# Altium project cooling_shield.PrjPCB
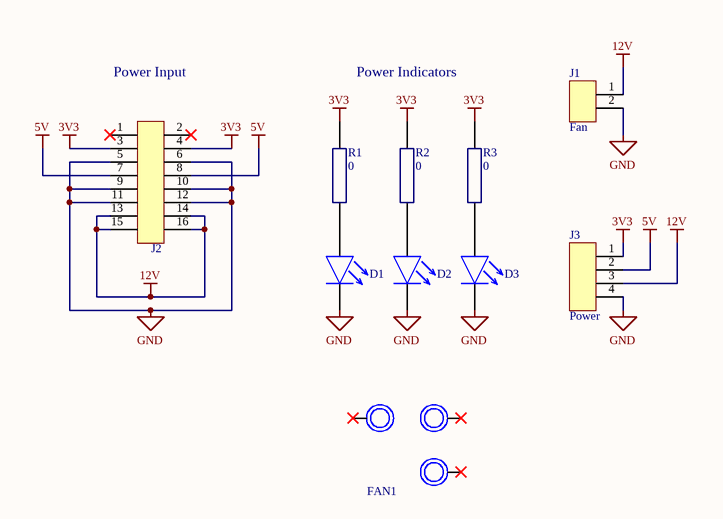
[diagram p0: cooling_shield.SchDoc]
1 sheet, 10 parts. Net scope: global (net labels, ports and power ports of the same name join across sheets).
Board file: cooling_shield.PcbDoc

## Sheet cooling_shield.SchDoc
size A

### Parts
D1  XZFBB45S-9  [PLCC-2]  (value not drawn)
D2  XZFBB45S-9  [PLCC-2]  (value not drawn)
D3  XZFBB45S-9  [PLCC-2]  (value not drawn)
FAN1  fan  [fan]  (value not drawn)
J1  Fan  [1718561002]
J2  DF11-16DP-2DSA(01)  [DF11-16DP-2DSA(01)_FLIP]  (value not drawn)
J3  Power  [282834-4]
R1  0  [RESC2012X07N_SAMSUNG]
R2  0  [RESC2012X07N_SAMSUNG]
R3  0  [RESC2012X07N_SAMSUNG]

### Nets
3V3: J2.3 J2.4 J3.1 R1.2 R2.2 R3.2
5V: J2.7 J2.8 J3.2
12V: J1.1 J2.13 J2.14 J2.15 J2.16 J3.3
GND: D1.2 D2.2 D3.2 J1.2 J2.5 J2.6 J2.9 J2.10 J2.11 J2.12 J3.4
NetD1_1: D1.1 R1.1
NetD2_1: D2.1 R2.1
NetD3_1: D3.1 R3.1

Not connected (* = marked no-connect by the designer): FAN1 1* 2* 3*; J2 1* 2*

### Notes on the sheet
- Power Input
- Power Indicators

### Library data of the parts
D1-D3 = XZFBB45S-9: LED BLUE CLEAR 2PLCC SMD; Manufacturer: SunLED; Configuration: Standard; Lens Color: Colorless; Millicandela Rating: 447mcd; Lens Style: Round with Flat Top; Lens Size: 2.40mm Dia; Voltage - Forward (Vf) (Typ): 3.3V; Current - Test: 20mA; Viewing Angle: 120°; Wavelength - Dominant: 470nm; Wavelength - Peak: 465nm; Supplier 1: Digi-Key; Manufacturer Part Number: XZFBB45S-9; RoHS: RoHS Compliant; Category: Optoelectronics; Stock 1: 5275; Pricing 1: 1=0.83, 10=0.651, 25=0.5456, 100=0.4752, 250=0.4224, 500=0.3696, 1000=0.2992 (USD); Packaging: Cut Tape (CT); Part Status: Active; Color: Blue; Lens Transparency: Clear; Mounting Type: Surface Mount, Bottom Entry; Features: -; Package / Case: 2-SMD, Z-Bend; Supplier Device Package: 2-PLCC; Size / Dimension: 3.20mm L x 2.80mm W; Height (Max): 1.90mm; ComponentLink1URL: http://www.sunledusa.com/products/spec/XZFBB45S-9.pdf; ComponentLink1Description: http://www.sunledusa.com/products/spec/XZFBB45S-9.pdf; Supplier Part Number 1: 1497-1233-1-ND
FAN1 = fan: RND STANDOFF M2.5X0.45 STEEL 8MM; Manufacturer: Wurth Electronics; Manufacturer Part Number: 9774080151R; Plating: Tin; Threaded/Unthreaded: Threaded; Outside Diameter: 0.201inch; Supplier 1: Digi-Key; Stock 1: 236; Pricing 1: 1=0.95, 10=0.918, 50=0.795, 100=0.739 (USD); Material: Steel; Length: 0.37inch; REACH SVHC: Unknown; Supplier Part Number 1: 732-7110-1-ND
J1 = 1718561002: Headers & Wire Housings KK Hdr Vrt 2 Ckt 2.54mm Pitch 15um Au; Manufacturer: Molex; Current Rating: 4A; Voltage Rating: 250V; Number of Positions: 2; Connector Type: Male Pin; Contact Post Length: 2.34mm; Glow Wire Compliant: Compliant; Supplier 1: Digi-Key; Manufacturer Part Number: 1718561002; Stock 1: 499; Pricing 1: 1=0.45, 10=0.426, 100=0.2979, 500=0.2554, 1000=0.2128, 5000=0.1824, 10000=0.1702 (USD); Mount: Through Hole; Weight: 0.007549oz; Color: Black; Contact Plating: Gold; Contact Material: Brass; Housing Material: Nylon; Min Operating Temperature: -40°C; Max Operating Temperature: 105°C; Package Quantity: 6000; Packaging: Bulk; Number of Rows: 1; Fastening Type: Friction; Contact Gender: Male; Termination: Solder; Number of Contacts: 2; Orientation: Vertical; Number of Circuits: 2; Pitch: 2.54mm; Contact Mating Length: 0.293inch; Radiation Hardening: No; Halogen Free: Low Halogen; Flammability Rating: UL94 V-2; ComponentLink1URL: http://www.mouser.com/ds/2/276/1718561002_PCB_HEADERS-294894.pdf?src-supplier=Mouser; ComponentLink1Description: http://www.mouser.com/ds/2/276/1718561002_PCB_HEADERS-294894.pdf?src-supplier=Mouser; Supplier Part Number 1: WM10286-ND
J2 = DF11-16DP-2DSA(01): Headers & Wire Housings 2MM V PCB HEADER 16P DR THRU-HOLE GLD; Manufacturer: Hirose Connector; Current Rating: 2 A; Mounting Angle: Vertical; Number of Positions: 16 Position; Voltage Rating: 250 V; Supplier 1: Digi-Key; Manufacturer Part Number: DF11-16DP-2DSA(01); RoHS: RoHS Compliant; Category: Headers & Wire Housings; Contact Plating: Gold; Number of Rows: 2 Row; Packaging: Bulk; Product: Headers; Series: DF11; Termination Style: Through Hole; Type: Shrouded; Brand: Hirose Connector; Contact Material: Brass; Mounting Style: -; Pitch: 2 mm; Standard Pack Qty: 100; RoHS - Mouser: Y; Minimum Order Quantity: 1; Reeling: False; ComponentLink1URL: http://www.mouser.com/datasheet/2/185/DF11_catalog-939040.pdf; ComponentLink1Description: http://www.mouser.com/datasheet/2/185/DF11_catalog-939040.pdf; Supplier Part Number 1: H2856-ND
J3 = 282834-4: 4 Position Wire to Board Terminal Block; Supplier 1: Digi-Key; Supplier Part Number 1: A98335-ND
R1-R3 = RC2012J000CS: Res Thick Film 0805 0 Ohm Molded SMD T/R; Manufacturer: Samsung; Resistance: 0mR; Tolerance: 5%; Power Rating: 125mW; Temperature Coefficient: 200ppm/°C; Supplier 1: Digi-Key; Manufacturer Part Number: RC2012J000CS; Stock 1: 259132; Pricing 1: 1=0.1, 10=0.052, 25=0.0372, 50=0.0284, 100=0.021, 250=0.016, 500=0.0128, 1000=0.0094 (USD); Mount: Surface Mount; Case/Package: 0805; Contact Plating: Tin; Case Code (Metric): 2012; Case Code (Imperial): 0805; Min Operating Temperature: -55°C; Max Operating Temperature: 155°C; Composition: Thick Film; Packaging: Tape and Reel; Number of Terminations: 2; Military Standard: Not; Max Power Dissipation: 125mW; Features: Moisture Resistant; Length: 2mm; Height: 0.024inch; Width: 0.049inch; Depth: 1.25mm; Radiation Hardening: No; ComponentLink1URL: https://www.verical.com/server-webapp/html/getDatasheet?partID=666031&src-supplier=Verical; ComponentLink1Description: https://www.verical.com/server-webapp/html/getDatasheet?partID=666031&src-supplier=Verical; ComponentLink2URL: http://www1.futureelectronics.com/doc/SAMSUNG%20PASSIVE/SAMSUNG%20PASSIVE%20RC1608F4303CS.pdf?src-supplier=Future+Electronics; ComponentLink2Description: http://www1.futureelectronics.com/doc/SAMSUNG%20PASSIVE/SAMSUNG%20PASSIVE%20RC1608F4303CS.pdf?src-supplier=Future+Electronics; ComponentLink3URL: http://www.samsungsem.com/kr/support/product-search/chip-resistor/RC2012J000CS.jsp?src-supplier=Digi-Key; ComponentLink3Description: http://www.samsungsem.com/kr/support/product-search/chip-resistor/RC2012J000CS.jsp?src-supplier=Digi-Key; ComponentLink4URL: http://datasheet.iiic.cc/samsung_[electro-mechanics]/RC2012J000CS.pdf?src-supplier=IIIC; ComponentLink4Description: http://datasheet.iiic.cc/samsung_[electro-mechanics]/RC2012J000CS.pdf?src-supplier=IIIC; Supplier Part Number 1: 1276-5466-1-ND